# Altium schematic sheet LAUNCHXL-F28069_B_1400922_6.SchDoc: LAUNCHXL-F28069_B_1400922
size 301 x 234 mm; Origin: Eagle; Date: 2014/12/8 15:08:46; SheetNumber: 7; GateName_1: G$1; SymbolName_1: FRAME_A_L; LibraryName: frames; DeviceSetName: FRAME_A_L; GateName_2: G$2; SymbolName_2: DOCFIELD; Sheet: Sheet:; REV: REV:; COMPANY: COMPANY:; Scale:1/1: Scale: 1/1; Drawn: Drawn; Checked: Checked; Approved: Approved; Embest: Embest
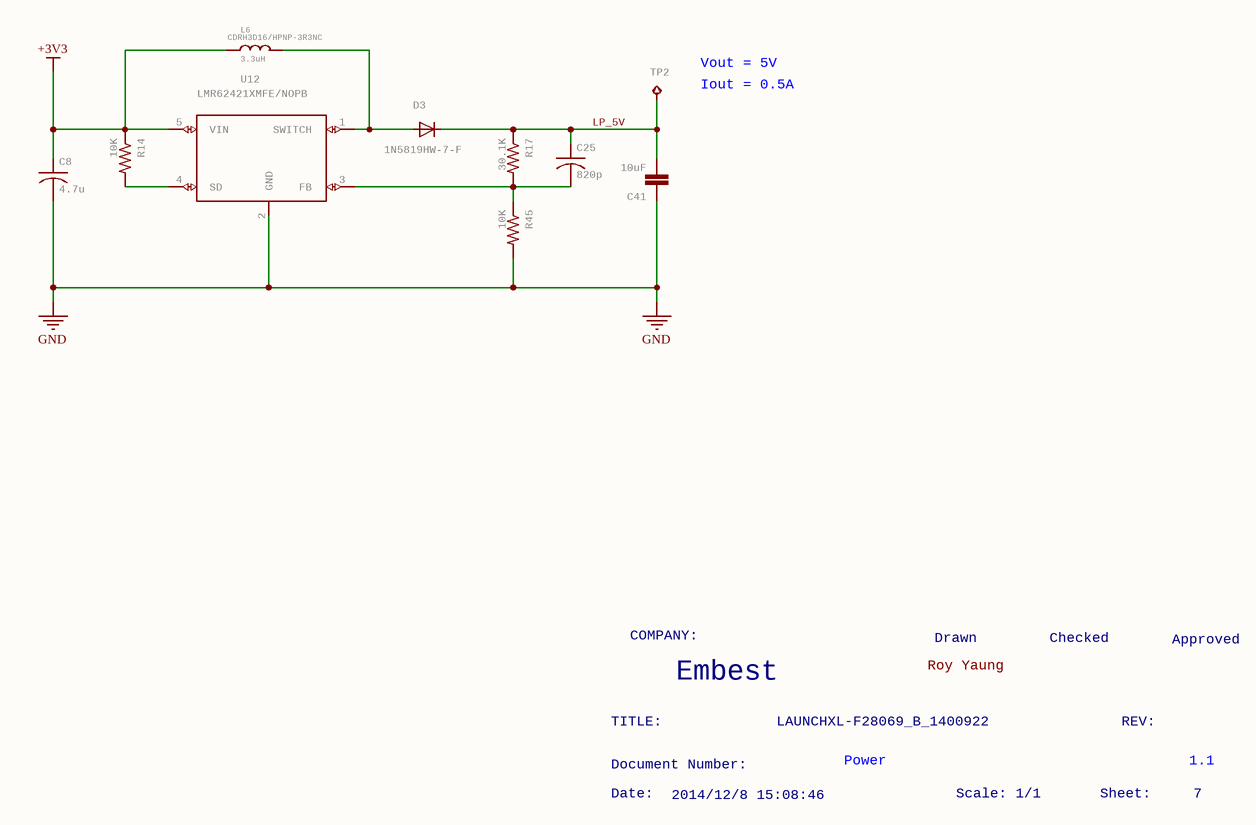
[diagram p0: LAUNCHXL-F28069_B_1400922_6.SchDoc]

## Parts
C8  4.7u  [C0402]
C25  820p  [C0402]
C41  10uF  [SPARKFUN_1210]
D3  1N5819HW-7-F  [SOD123]
L6  3.3uH  [INDUCT-3_7*3_5]
R14  10K  [R0402]
R17  30.1K  [R0402]
R45  10K  [R0402]
TP2  TESTPAD_TPB1,27  [TESTPAD_B1,27]  (value not drawn)
U12  LMR62421XMFE/NOPB  [SOT23-5-DBV]

## Nets
+3V3: C8.1 L6.P$1 R14.1 U12.5(VIN)
GND: C8.2 C41.1 R45.2 U12.2(GND)
LP_5V: C25.1 C41.2 D3.C R17.1 TP2.TP
NetC25_2: C25.2 R17.2 R45.1 U12.3(FB)
NetD3_A: D3.A L6.P$2 U12.1(SWITCH)
NetR14_2: R14.2 U12.4(SD)

## Notes on the sheet
- (near L6) CDRH3D16/HPNP-3R3NC
- (near TP2) Vout = 5V
- (near TP2) Iout = 0.5A
- COMPANY:
- Roy Yaung
- Drawn
- Checked
- Approved
- TITLE:
- Embest
- LAUNCHXL-F28069_B_1400922
- REV:
- Date:
- Document Number:
- 2014/12/8 15:08:46
- Power
- Scale: 1/1
- Sheet:
- 1.1
- 7

## Library data of the parts
C8 C25 = C-USC0402: CAPACITOR, American symbol; GateName_1: G$1; SymbolName_1: C-US; DeviceName: C0402; LibraryName: rcl; DeviceSetName: C-US
C41 = SPARKFUN_CAP1210: CapacitorStandard 0603 ceramic capacitor, and 0.1" leaded capacitor.; GateName_1: G$1; DeviceName: 1210; SymbolName_1: SPARKFUN_CAP; LibraryName: RF430FRL152H_EVM_a; DeviceSetName: SPARKFUN_CAP
D3 = 1N4148: DIODE   high speed (Philips); GateName_1: G$1; SymbolName_1: D; LibraryName: diode; DeviceSetName: 1N4148
L6 = VLF4012A: GateName_1: 1; SymbolName_1: INDUCTOR; LibraryName: LAUNCHXL-F28027; DeviceSetName: VLF4012A
R14 R17 R45 = R-US_R0402: RESISTOR, American symbol; GateName_1: G$1; SymbolName_1: R-US; DeviceSetName: R-US_; DeviceName: R0402; LibraryName: rcl
TP2 = TESTPAD_TPB1,27: Test pad; GateName_1: G$1; DeviceName: B1,27; SymbolName_1: TESTPAD_TP; LibraryName: RF430FRL152H_EVM_a; DeviceSetName: TESTPAD_TP
U12 = LMR62421XMFE/NOPB: GateName_1: G$1; SymbolName_1: LMR62421; LibraryName: LAUNCHXL-F28027; DeviceSetName: LMR62421XMFE/NOPB